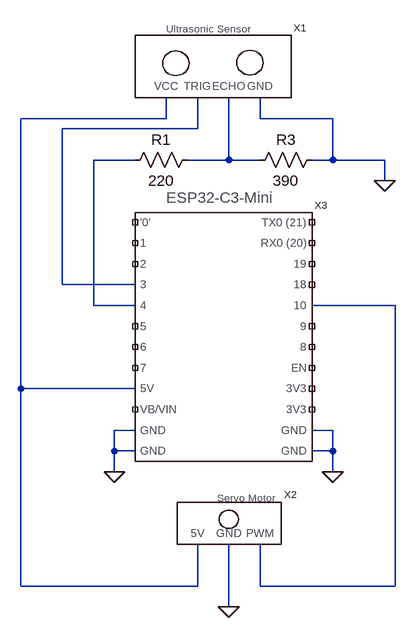
[diagram p0: schematic trashcan.asc]
trashcan.asc, the LTspice schematic file:
Version 4.1
SHEET 1 880 680
WIRE 224 -288 224 -320
WIRE 224 -288 0 -288
WIRE 368 -288 368 -320
WIRE 480 -288 368 -288
WIRE 272 -272 272 -320
WIRE 272 -272 64 -272
WIRE 176 -224 112 -224
WIRE 320 -224 320 -320
WIRE 320 -224 256 -224
WIRE 368 -224 320 -224
WIRE 480 -224 480 -288
WIRE 480 -224 448 -224
WIRE 560 -224 480 -224
WIRE 560 -192 560 -224
WIRE 64 -32 64 -272
WIRE 176 -32 64 -32
WIRE 112 0 112 -224
WIRE 176 0 112 0
WIRE 576 0 448 0
WIRE 0 128 0 -288
WIRE 176 128 0 128
WIRE 176 192 144 192
WIRE 480 192 448 192
WIRE 144 224 144 192
WIRE 176 224 144 224
WIRE 480 224 480 192
WIRE 480 224 448 224
WIRE 144 256 144 224
WIRE 480 256 480 224
WIRE 0 432 0 128
WIRE 272 432 272 368
WIRE 272 432 0 432
WIRE 368 432 368 368
WIRE 576 432 576 0
WIRE 576 432 368 432
WIRE 320 464 320 368
FLAG 144 256 0
FLAG 480 256 0
FLAG 320 464 0
FLAG 560 -192 0
SYMBOL symbols\\ultrasonicSensor 288 -304 R0
SYMATTR InstName X1
SYMBOL symbols\\servoMotor 304 368 R0
SYMATTR InstName X2
SYMBOL symbols\\ESP32-C3-Mini 224 -64 R0
SYMATTR InstName X3
SYMBOL res 464 -240 R90
WINDOW 0 0 56 VBottom 2
WINDOW 3 32 56 VTop 2
SYMATTR InstName R3
SYMATTR Value 390
SYMBOL res 272 -240 R90
WINDOW 0 0 56 VBottom 2
WINDOW 3 32 56 VTop 2
SYMATTR InstName R1
SYMATTR Value 220

The netlist it stands for:
* trashcan.asc
X§X1 N001 N002 N004 0 ultrasonicSensor  ; pins VCC TRIG ECHO GND
X§X2 N001 0 N005 servoMotor  ; pins 5V GND PWM
X§X3 NC_01 NC_02 NC_03 N002 N003 NC_04 NC_05 NC_06 N001 NC_07 0 0 NC_08 NC_09 NC_10 NC_11 N005 NC_12 NC_13 NC_14 NC_15 NC_16 0 0 ESP32-C3-Mini  ; pins '0' 1 2 3 4 5 6 7 5V VB/VIN GND GND TX0_(21) RX0_(20) 19 18 10 9 8 EN 3V3 3V3 GND GND
R3 0 N004 390
R1 N004 N003 220
.backanno
.end